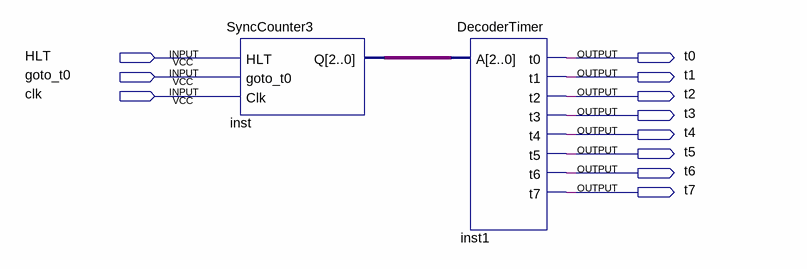
[diagram p0: schematic sheet]
// Quartus schematic Timer.bdf as structural Verilog: 2 symbols, 11 pins
module Timer (
  input  HLT,
  input  goto_t0,
  input  clk,
  output t0,
  output t1,
  output t2,
  output t3,
  output t4,
  output t5,
  output t6,
  output t7
);

  wire [2:0] inst_q;

  SyncCounter3 inst (.HLT(HLT), .goto_t0(goto_t0), .Clk(clk), .Q(inst_q));
  DecoderTimer inst1 (.A(inst_q), .t0(t0), .t1(t1), .t2(t2), .t3(t3), .t4(t4), .t5(t5), .t6(t6), .t7(t7));
endmodule
